# Altium schematic sheet LISC_CPLD.SchDoc: LISC
size A4; Date: 2018-04-21; Author: EP; Organization: eptecon; Revision: A; SheetNumber: 4; SheetTotal: 5; PartNumber: 200511-000; DesignStatus: in progress; Project: LISC-XC95144XL; SheetTitle: CPLD; ProjectName: Project Name
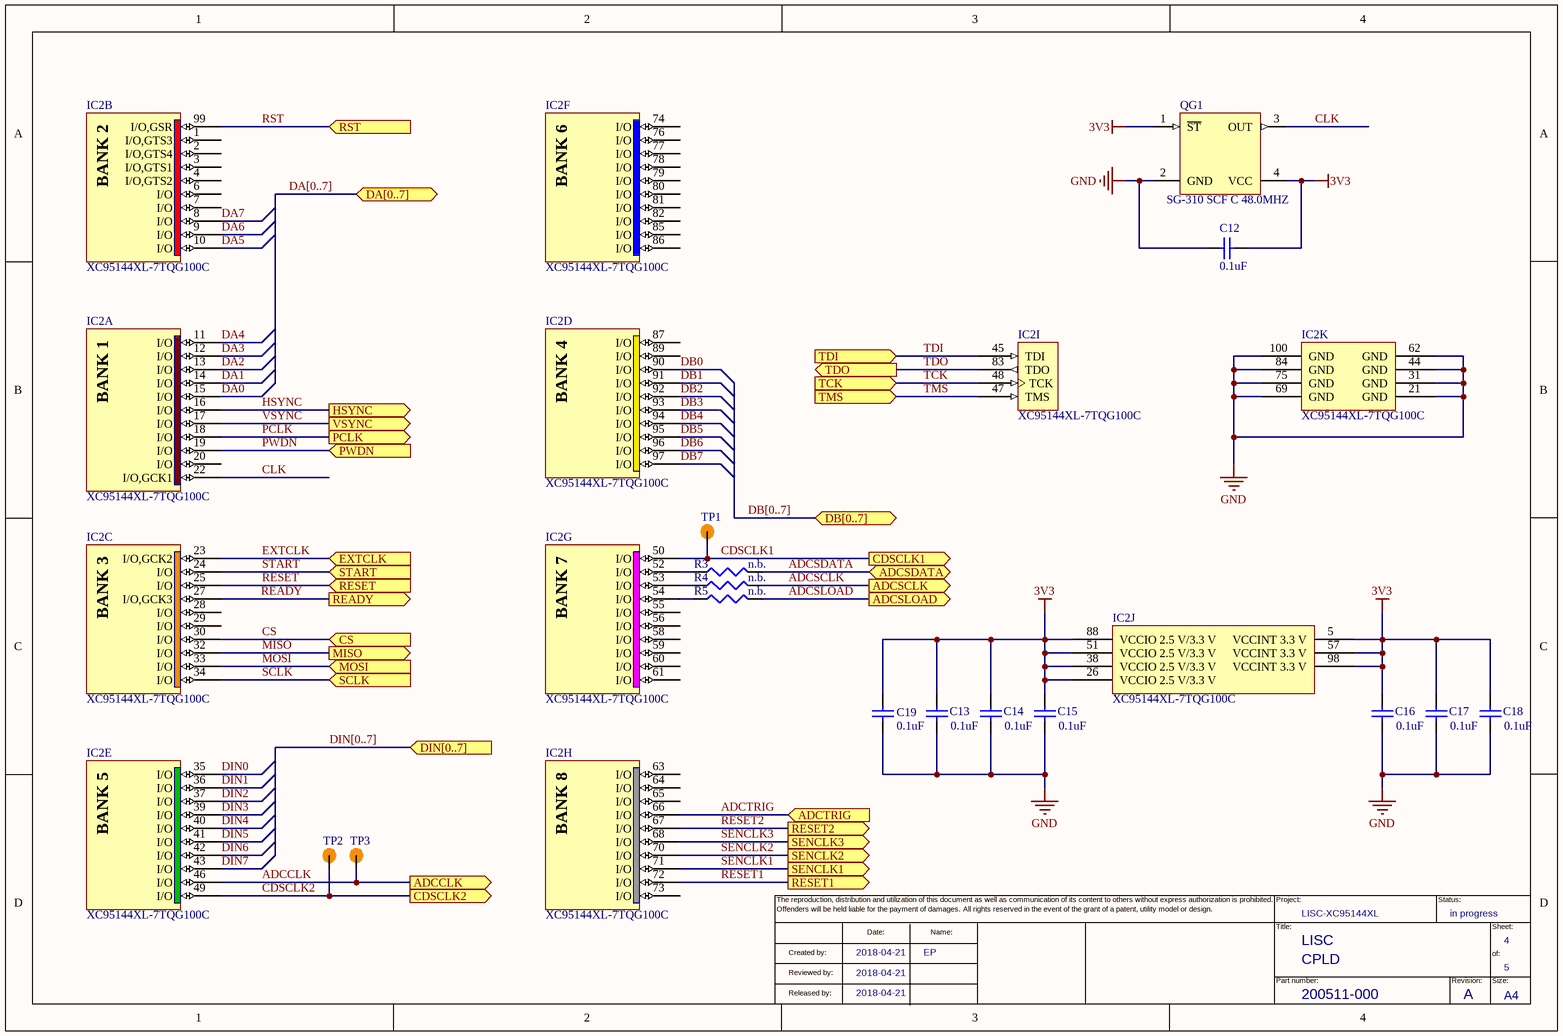
[diagram p0: LISC_CPLD.SchDoc]

## Parts
C12  value 0.1uF  [1608[0603]]  (hidden comment: Cap Semi)
C13  value 0.1uF  [1608[0603]]
C14  value 0.1uF  [1608[0603]]
C15  value 0.1uF  [1608[0603]]
C16  value 0.1uF  [1608[0603]]
C17  value 0.1uF  [1608[0603]]
C18  value 0.1uF  [1608[0603]]
C19  value 0.1uF  [1608[0603]]
IC2  XC95144XL-7TQG100C  [TQG100_N]  (parts A,B,C,D,E,F,G,H,I,J,K of 11)
QG1  SG-310 SCF C 48.0MHZ  [SG-310_Series]
R3  value n.b.  [J1-0603]
R4  value n.b.  [J1-0603]
R5  value n.b.  [J1-0603]
TP1  TP_SMD  [TP100_200_NS]  (value not drawn)
TP2  TP_SMD  [TP100_200_NS]  (value not drawn)
TP3  TP_SMD  [TP100_200_NS]  (value not drawn)

## Ports
ADCCLK (out), ADCSCLK (out), ADCSDATA (bidir), ADCSLOAD (out), ADCTRIG (in), CDSCLK1 (out), CDSCLK2 (out), CS (in), DA[0..7] (bidir), DB[0..7] (bidir), DIN[0..7] (in), EXTCLK (in), HSYNC (out), MISO (out), MOSI (in), PCLK (out), PWDN (in), READY (out), RESET1 (out), RESET2 (out), RESET (in), RST (in), SCLK (in), SENCLK1 (out), SENCLK2 (out), SENCLK3 (out), START (in), TCK (in), TDI (in), TDO (out), TMS (in), VSYNC (out)

## Nets
3V3: C12.2 C13.1 C14.1 C15.1 C16.1 C17.1 C18.1 C19.1 IC2.5(VCCINT_3.3_V) IC2.26(VCCIO_2.5_V/3.3_V) IC2.38(VCCIO_2.5_V/3.3_V) IC2.51(VCCIO_2.5_V/3.3_V) IC2.57(VCCINT_3.3_V) IC2.88(VCCIO_2.5_V/3.3_V) IC2.98(VCCINT_3.3_V) QG1.1(~{ST}) QG1.4(VCC)
GND: C12.1 C13.2 C14.2 C15.2 C16.2 C17.2 C18.2 C19.2 IC2.21(GND) IC2.31(GND) IC2.44(GND) IC2.62(GND) IC2.69(GND) IC2.75(GND) IC2.84(GND) IC2.100(GND) QG1.2(GND)
ADCCLK: IC2.46(I/O) TP3.1 ; port ADCCLK
ADCSCLK: R4.2 ; port ADCSCLK
ADCSDATA: R3.2 ; port ADCSDATA
ADCSLOAD: R5.2 ; port ADCSLOAD
ADCTRIG: IC2.66(I/O) ; port ADCTRIG
CDSCLK1: IC2.50(I/O) TP1.1 ; port CDSCLK1
CDSCLK2: IC2.49(I/O) TP2.1 ; port CDSCLK2
CLK: IC2.22(I/O,GCK1) QG1.3(OUT)
CS: IC2.30(I/O) ; port CS
DA0: IC2.15(I/O)
DA1: IC2.14(I/O)
DA2: IC2.13(I/O)
DA3: IC2.12(I/O)
DA4: IC2.11(I/O)
DA5: IC2.10(I/O)
DA6: IC2.9(I/O)
DA7: IC2.8(I/O)
DB0: IC2.90(I/O)
DB1: IC2.91(I/O)
DB2: IC2.92(I/O)
DB3: IC2.93(I/O)
DB4: IC2.94(I/O)
DB5: IC2.95(I/O)
DB6: IC2.96(I/O)
DB7: IC2.97(I/O)
DIN0: IC2.35(I/O)
DIN1: IC2.36(I/O)
DIN2: IC2.37(I/O)
DIN3: IC2.39(I/O)
DIN4: IC2.40(I/O)
DIN5: IC2.41(I/O)
DIN6: IC2.42(I/O)
DIN7: IC2.43(I/O)
EXTCLK: IC2.23(I/O,GCK2) ; port EXTCLK
HSYNC: IC2.16(I/O) ; port HSYNC
MISO: IC2.32(I/O) ; port MISO
MOSI: IC2.33(I/O) ; port MOSI
PCLK: IC2.18(I/O) ; port PCLK
PWDN: IC2.19(I/O) ; port PWDN
READY: IC2.27(I/O,GCK3) ; port READY
RESET: IC2.25(I/O) ; port RESET
RESET1: IC2.72(I/O) ; port RESET1
RESET2: IC2.67(I/O) ; port RESET2
RST: IC2.99(I/O,GSR) ; port RST
SCLK: IC2.34(I/O) ; port SCLK
SENCLK1: IC2.71(I/O) ; port SENCLK1
SENCLK2: IC2.70(I/O) ; port SENCLK2
SENCLK3: IC2.68(I/O) ; port SENCLK3
START: IC2.24(I/O) ; port START
TCK: IC2.48(TCK) ; port TCK
TDI: IC2.45(TDI) ; port TDI
TDO: IC2.83(TDO) ; port TDO
TMS: IC2.47(TMS) ; port TMS
VSYNC: IC2.17(I/O) ; port VSYNC
NetIC2_52: IC2.52(I/O) R3.1
NetIC2_53: IC2.53(I/O) R4.1
NetIC2_54: IC2.54(I/O) R5.1

Not connected (* = marked no-connect by the designer): IC2 1(I/O,GTS3) 2(I/O,GTS4) 3(I/O,GTS1) 4(I/O,GTS2) 6(I/O) 7(I/O) 20(I/O) 28(I/O) 29(I/O) 55(I/O) 56(I/O) 58(I/O) 59(I/O) 60(I/O) 61(I/O) 63(I/O) 64(I/O) 65(I/O) 73(I/O) 74(I/O) 76(I/O) 77(I/O) 78(I/O) 79(I/O) 80(I/O) 81(I/O) 82(I/O) 85(I/O) 86(I/O) 87(I/O) 89(I/O)

## Buses and harness runs
bus DA[0..7] = port DA[0..7]
bus DB[0..7] = port DB[0..7]
bus DIN[0..7] = port DIN[0..7]

## Notes on the sheet
- The reproduction, distribution and utilization of this document as well as communication of its content to others without express authorization is prohibited.
- Offenders will be held liable for the payment of damages.
- All rights reserved in the event of the grant of a patent, utility model or design.
- Project:
- Status:
- Created by:
- Reviewed by:
- Date:
- Name:
- Title:
- Part number:
- Revision:
- Size:
- Sheet:
- of:
- Released by:
- A4
- (in symbol XC95144XL-7TQG100C, part A) BANK 1
- (in symbol XC95144XL-7TQG100C, part B) BANK 2
- (in symbol XC95144XL-7TQG100C, part C) BANK 3
- (in symbol XC95144XL-7TQG100C, part D) BANK 4
- (in symbol XC95144XL-7TQG100C, part E) BANK 5
- (in symbol XC95144XL-7TQG100C, part F) BANK 6
- (in symbol XC95144XL-7TQG100C, part G) BANK 7
- (in symbol XC95144XL-7TQG100C, part H) BANK 8

## Library data of the parts
C12-C19 = Cap Semi: Capacitor (Semiconductor SIM Model); Published: 8-Jun-2000; LatestRevisionDate: 29-May-2009; LatestRevisionNote: IPC-7351 Footprint Added.; PackageReference: C1206; Publisher: Altium Limited; PackageDescription: Chip Capacitor
IC2 = XC95144XL-7TQG100C: FastFLASH XC900XL, 3.3V High-Performance CPLD with 144 Macrocells, 100-Pin TQFP, Commercial Grade, Pb-Free; Published: 8-Sep-2006; DatasheetVersion: ver1.9, Mar-2006; PackageVersion: ver1.2, Jun-2004; PackageReference: TQG100; Publisher: Altium Limited; PackageDescription: 100-Pin Thin Quad Flat Pack (TQG100) - Pb-Free; ComponentLink1Description: Manufacturer Link; ComponentLink1URL: http://www.xilinx.com/products/silicon_solutions/cplds/xc9500_series/xc9500xl/index.htm; ComponentLink2Description: Datasheet; ComponentLink2URL: http://direct.xilinx.com/bvdocs/publications/ds056.pdf
QG1 = SG-310 SCF C 20.0MHZ: EPSON TOYOCOM - SG-310 SCF C 20.0MHZ - OSZILLATOR, SM 3,2X2,5MM 20,0MHZ; Supplier 1: Farnell; Manufacturer: EPSON TOYOCOM; Manufacturer Part Number: SG-310 SCF C 20.0MHZ; RoHS: YES; Stock 1: 1225; Pricing 1: 1=3,39, 10=2,77, 100=2,39, 250=2,04, 500=1,97 (EUR); ComponentLink1URL: http://www.farnell.com/datasheets/57484.pdf; ComponentLink1Description: http://www.farnell.com/datasheets/57484.pdf; Supplier Part Number 1: 1278064
R3-R5 = Res3: Resistor; Published: 8-Jun-2000; LatestRevisionDate: 29-May-2009; LatestRevisionNote: IPC-7351 Footprint Added.; PackageReference: J1-0603; Publisher: Altium Limited; PackageDescription: Chip Resistor